# Altium schematic sheet Cap_Sensor_Hand.SchDoc
size A3
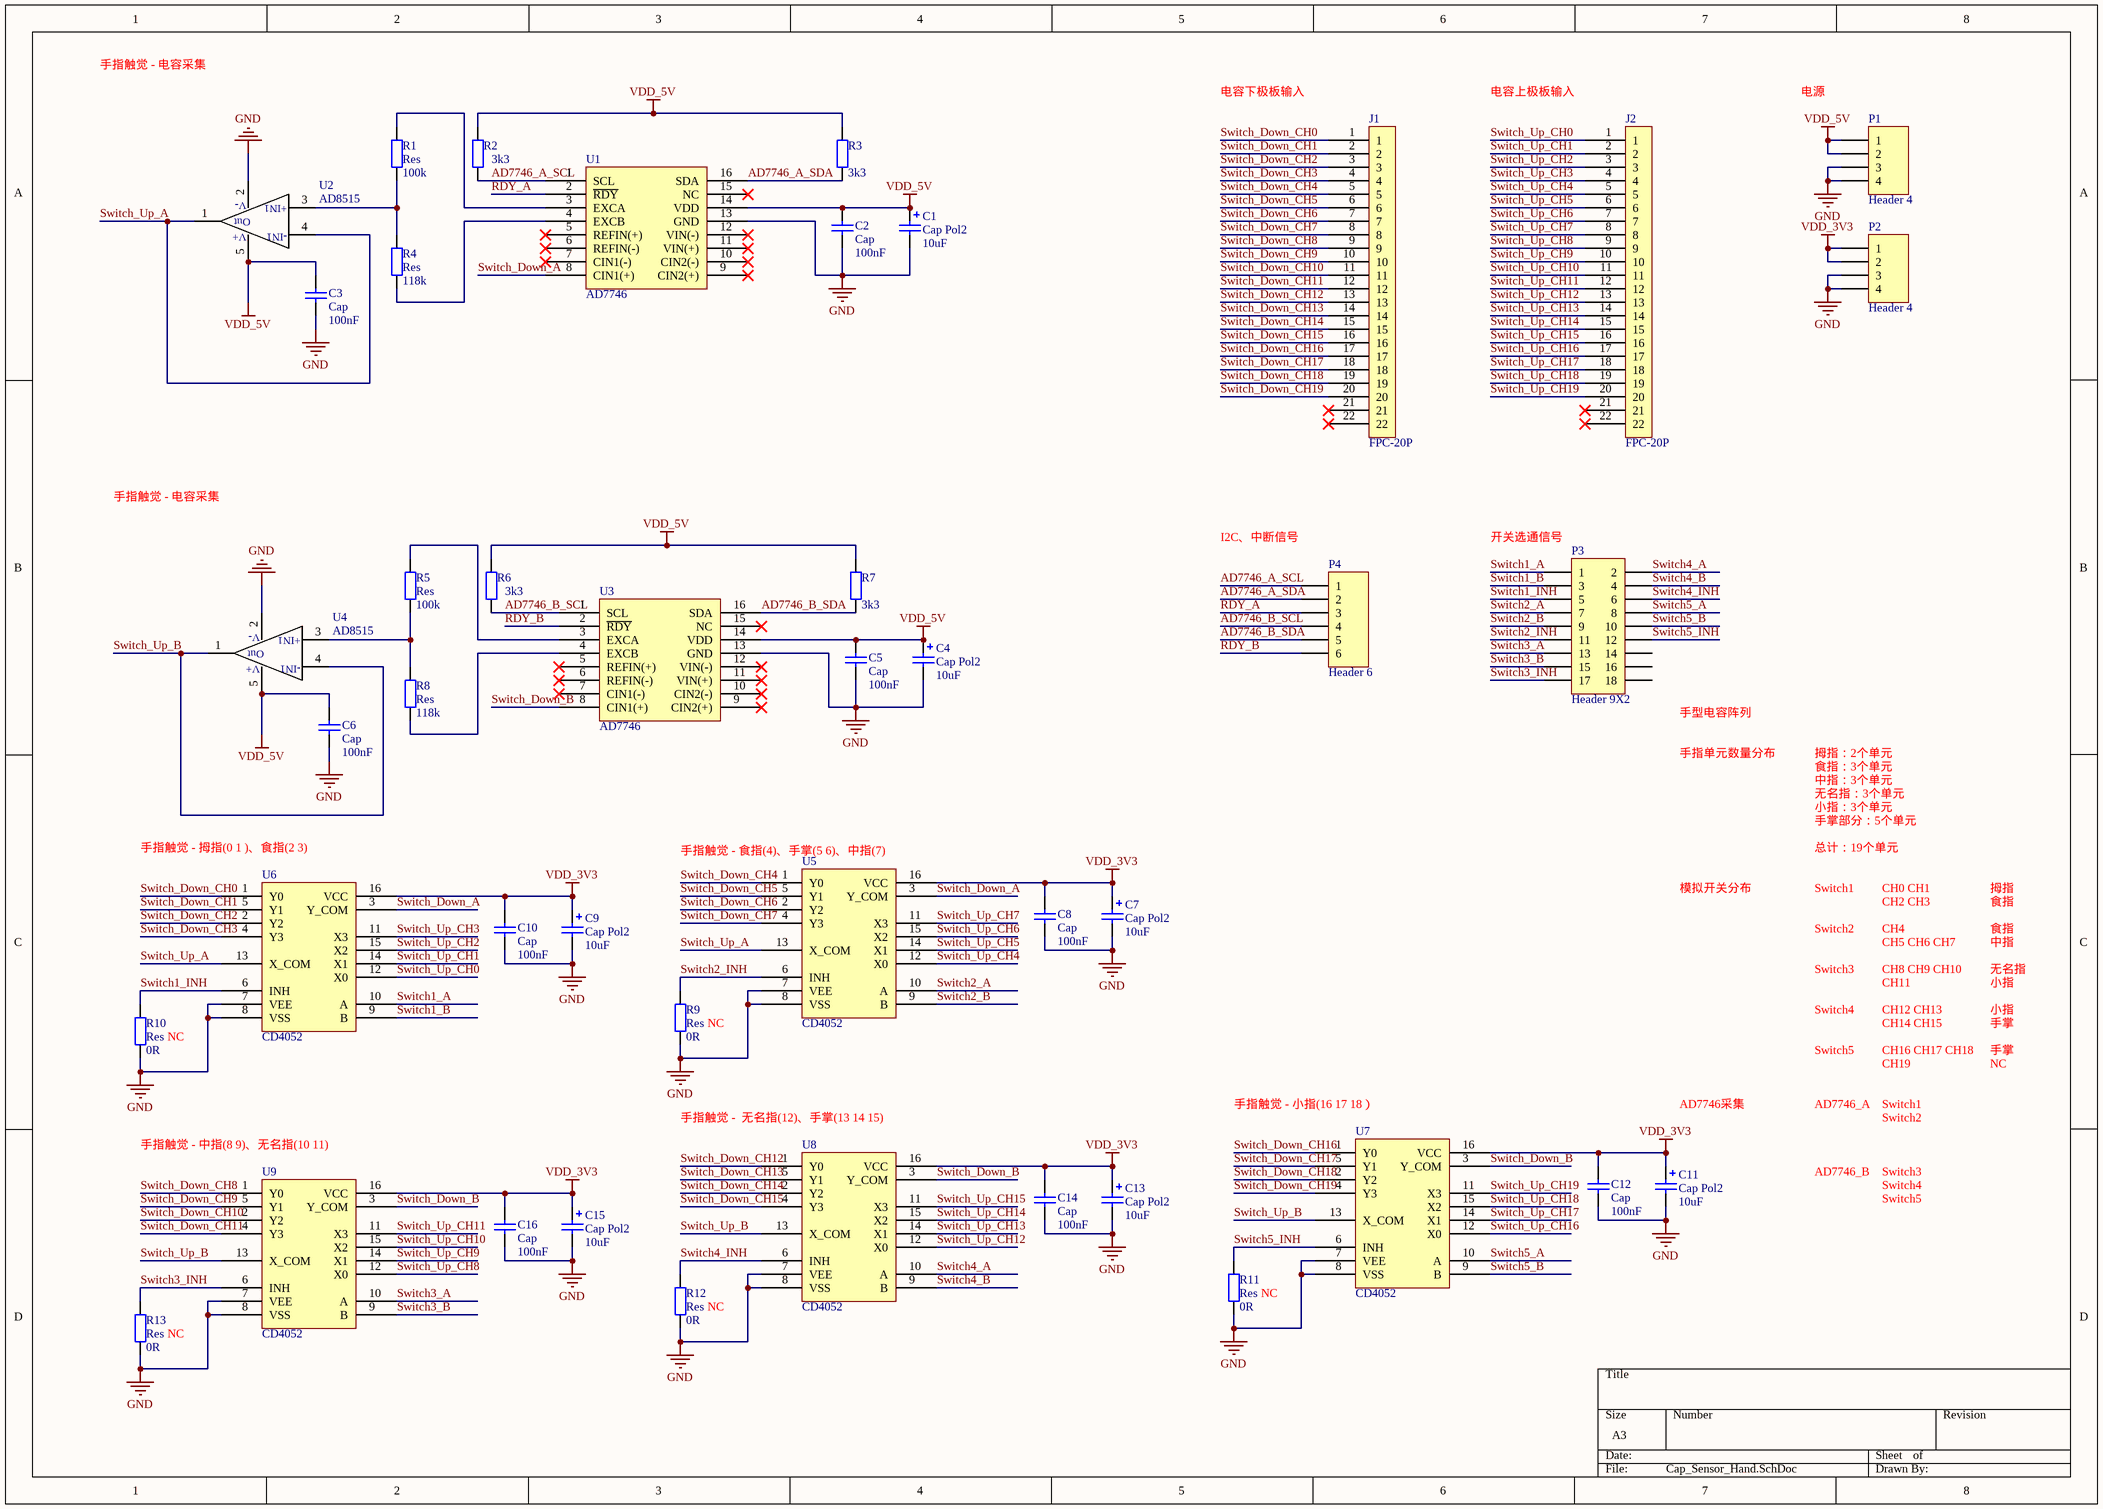
[diagram p0: Cap_Sensor_Hand.SchDoc]

## Parts
C1  Cap Pol2  value 10uF  [Cap-TA]
C2  Cap  value 100nF  [0805C]
C3  Cap  value 100nF  [0805C]
C4  Cap Pol2  value 10uF  [Cap-TA]
C5  Cap  value 100nF  [0805C]
C6  Cap  value 100nF  [0805C]
C7  Cap Pol2  value 10uF  [Cap-TA]
C8  Cap  value 100nF  [0805C]
C9  Cap Pol2  value 10uF  [Cap-TA]
C10  Cap  value 100nF  [0805C]
C11  Cap Pol2  value 10uF  [Cap-TA]
C12  Cap  value 100nF  [0805C]
C13  Cap Pol2  value 10uF  [Cap-TA]
C14  Cap  value 100nF  [0805C]
C15  Cap Pol2  value 10uF  [Cap-TA]
C16  Cap  value 100nF  [0805C]
J1  FPC-20P  [FPC20-0.5]
J2  FPC-20P  [FPC20-0.5]
P1  Header 4  [HDR1X4]
P2  Header 4  [HDR1X4]
P3  Header 9X2  [HDR2X9]
P4  Header 6  [HDR1X6]
R1  Res  value 100k  [0805R]
R2  value 3k3  [0805R]  (hidden comment: Res)
R3  value 3k3  [0805R]  (hidden comment: Res)
R4  Res  value 118k  [0805R]
R5  Res  value 100k  [0805R]
R6  value 3k3  [0805R]  (hidden comment: Res)
R7  value 3k3  [0805R]  (hidden comment: Res)
R8  Res  value 118k  [0805R]
R9  Res  value 0R  [0805R]
R10  Res  value 0R  [0805R]
R11  Res  value 0R  [0805R]
R12  Res  value 0R  [0805R]
R13  Res  value 0R  [0805R]
U1  AD7746  [TSSOP16]
U2  AD8515  [sot23-5]
U3  AD7746  [TSSOP16]
U4  AD8515  [sot23-5]
U5  CD4052  [sop16]
U6  CD4052  [SOP16]
U7  CD4052  [sop16]
U8  CD4052  [sop16]
U9  CD4052  [sop16]

## Nets
GND: C1.2 C2.1 C3.1 C4.2 C5.1 C6.1 C7.2 C8.1 C9.2 C10.1 C11.2 C12.1 C13.2 C14.1 C15.2 C16.1 P1.3 P1.4 P2.3 P2.4 R9.2 R10.2 R11.2 R12.2 R13.2 U1.13(GND) U2.2(V-) U3.13(GND) U4.2(V-) U5.7(VEE) U5.8(VSS) U6.7(VEE) U6.8(VSS) U7.7(VEE) U7.8(VSS) U8.7(VEE) U8.8(VSS) U9.7(VEE) U9.8(VSS)
VDD_3V3: C7.1 C8.2 C9.1 C10.2 C11.1 C12.2 C13.1 C14.2 C15.1 C16.2 P2.1 P2.2 U5.16(VCC) U6.16(VCC) U7.16(VCC) U8.16(VCC) U9.16(VCC)
VDD_5V: C1.1 C2.2 C3.2 C4.1 C5.2 C6.2 P1.1 P1.2 R2.2 R3.2 R6.2 R7.2 U1.14(VDD) U2.5(V+) U3.14(VDD) U4.5(V+)
AD7746_A_SCL: P4.1 R2.1 U1.1(SCL)
AD7746_A_SDA: P4.2 R3.1 U1.16(SDA)
AD7746_B_SCL: P4.4 R6.1 U3.1(SCL)
AD7746_B_SDA: P4.5 R7.1 U3.16(SDA)
RDY_A: P4.3 U1.2(~{RDY})
RDY_B: P4.6 U3.2(~{RDY})
Switch1_A: P3.1 U6.10(A)
Switch1_B: P3.3 U6.9(B)
Switch1_INH: P3.5 R10.1 U6.6(INH)
Switch2_A: P3.7 U5.10(A)
Switch2_B: P3.9 U5.9(B)
Switch2_INH: P3.11 R9.1 U5.6(INH)
Switch3_A: P3.13 U9.10(A)
Switch3_B: P3.15 U9.9(B)
Switch3_INH: P3.17 R13.1 U9.6(INH)
Switch4_A: P3.2 U8.10(A)
Switch4_B: P3.4 U8.9(B)
Switch4_INH: P3.6 R12.1 U8.6(INH)
Switch5_A: P3.8 U7.10(A)
Switch5_B: P3.10 U7.9(B)
Switch5_INH: P3.12 R11.1 U7.6(INH)
Switch_Down_A: U1.8(CIN1(+)) U5.3(Y_COM) U6.3(Y_COM)
Switch_Down_B: U3.8(CIN1(+)) U7.3(Y_COM) U8.3(Y_COM) U9.3(Y_COM)
Switch_Down_CH0: J1.1 U6.1(Y0)
Switch_Down_CH1: J1.2 U6.5(Y1)
Switch_Down_CH2: J1.3 U6.2(Y2)
Switch_Down_CH3: J1.4 U6.4(Y3)
Switch_Down_CH4: J1.5 U5.1(Y0)
Switch_Down_CH5: J1.6 U5.5(Y1)
Switch_Down_CH6: J1.7 U5.2(Y2)
Switch_Down_CH7: J1.8 U5.4(Y3)
Switch_Down_CH8: J1.9 U9.1(Y0)
Switch_Down_CH9: J1.10 U9.5(Y1)
Switch_Down_CH10: J1.11 U9.2(Y2)
Switch_Down_CH11: J1.12 U9.4(Y3)
Switch_Down_CH12: J1.13 U8.1(Y0)
Switch_Down_CH13: J1.14 U8.5(Y1)
Switch_Down_CH14: J1.15 U8.2(Y2)
Switch_Down_CH15: J1.16 U8.4(Y3)
Switch_Down_CH16: J1.17 U7.1(Y0)
Switch_Down_CH17: J1.18 U7.5(Y1)
Switch_Down_CH18: J1.19 U7.2(Y2)
Switch_Down_CH19: J1.20 U7.4(Y3)
Switch_Up_A: U2.1(Out1) U2.4(-IN) U5.13(X_COM) U6.13(X_COM)
Switch_Up_B: U4.1(Out1) U4.4(-IN) U7.13(X_COM) U8.13(X_COM) U9.13(X_COM)
Switch_Up_CH0: J2.1 U6.12(X0)
Switch_Up_CH1: J2.2 U6.14(X1)
Switch_Up_CH2: J2.3 U6.15(X2)
Switch_Up_CH3: J2.4 U6.11(X3)
Switch_Up_CH4: J2.5 U5.12(X0)
Switch_Up_CH5: J2.6 U5.14(X1)
Switch_Up_CH6: J2.7 U5.15(X2)
Switch_Up_CH7: J2.8 U5.11(X3)
Switch_Up_CH8: J2.9 U9.12(X0)
Switch_Up_CH9: J2.10 U9.14(X1)
Switch_Up_CH10: J2.11 U9.15(X2)
Switch_Up_CH11: J2.12 U9.11(X3)
Switch_Up_CH12: J2.13 U8.12(X0)
Switch_Up_CH13: J2.14 U8.14(X1)
Switch_Up_CH14: J2.15 U8.15(X2)
Switch_Up_CH15: J2.16 U8.11(X3)
Switch_Up_CH16: J2.17 U7.12(X0)
Switch_Up_CH17: J2.18 U7.14(X1)
Switch_Up_CH18: J2.19 U7.15(X2)
Switch_Up_CH19: J2.20 U7.11(X3)
NetR1_1: R1.1 U1.3(EXCA)
NetR1_2: R1.2 R4.1 U2.3(+IN)
NetR4_2: R4.2 U1.4(EXCB)
NetR5_1: R5.1 U3.3(EXCA)
NetR5_2: R5.2 R8.1 U4.3(+IN)
NetR8_2: R8.2 U3.4(EXCB)

Not connected (* = marked no-connect by the designer): J1 21* 22*; J2 21* 22*; P3 14 16 18; U1 5(REFIN(+))* 6(REFIN(-))* 7(CIN1(-))* 9(CIN2(+))* 10(CIN2(-))* 11(VIN(+))* 12(VIN(-))* 15(NC)*; U3 5(REFIN(+))* 6(REFIN(-))* 7(CIN1(-))* 9(CIN2(+))* 10(CIN2(-))* 11(VIN(+))* 12(VIN(-))* 15(NC)*

## Notes on the sheet
- 手指触觉 - 电容采集
- 电容下极板输入
- 电容上极板输入
- 电源
- I2C、中断信号
- (near P3) 开关选通信号
- 手型电容阵列
- 手指单元数量分布
- 拇指：2个单元
- 食指：3个单元
- 中指：3个单元
- (near U6) 手指触觉 - 拇指(0 1 )、食指(2 3)
- (near U5) 手指触觉 - 食指(4)、手掌(5 6)、中指(7)
- 无名指：3个单元
- 小指：3个单元
- 手掌部分：5个单元
- 总计：19个单元
- 模拟开关分布
- Switch1
- CH0 CH1
- CH2 CH3
- 拇指
- 食指
- Switch2
- Switch3
- CH4
- CH5 CH6 CH7
- CH8 CH9 CH10
- CH11
- 中指
- 无名指
- 小指
- (near R10) NC
- (near R9) NC
- Switch4
- Switch5
- CH12 CH13
- CH14 CH15
- CH16 CH17 CH18
- 手掌
- (near U8) 手指触觉 -  无名指(12)、手掌(13 14 15)
- (near U7) 手指触觉 - 小指(16 17 18）
- AD7746采集
- AD7746_A
- CH19
- NC
- (near U9) 手指触觉 - 中指(8 9)、无名指(10 11)
- AD7746_B
- (near R12) NC
- (near R11) NC
- (near R13) NC
- (in symbol AD8515) +IN1; Out; -IN1

## Library data of the parts
C1 C4 C7 C9 C11 C13 C15 = Cap Pol2: Polarized Capacitor (Axial); Published: 8-Jun-2000; LatestRevisionDate: 17-Jul-2002; LatestRevisionNote: Re-released for DXP Platform.; PackageReference: POLAR0.8; Publisher: Altium Limited; PackageDescription: Polarized Capacitor; 2 Leads
C2 C3 C5 C6 C8 C10 C12 C14 C16 = Cap: Capacitor; Published: 8-Jun-2000; LatestRevisionDate: 17-Jul-2002; LatestRevisionNote: Re-released for DXP Platform.; PackageReference: RAD-0.3; Publisher: Altium Limited; PackageDescription: Radial Cap, Thru-Hole; 2 Leads; 0.3 in Pin Spacing
J1 J2 = FPC_20P
P1 P2 = Header 4: Header, 4-Pin; LatestRevisionDate: 17-Jul-2002; LatestRevisionNote: Re-released for DXP Platform.; Publisher: Altium Limited
P3 = Header 9X2: Header, 9-Pin, Dual row; LatestRevisionDate: 17-Jul-2002; LatestRevisionNote: Re-released for DXP Platform.; Publisher: Altium Limited
P4 = Header 6: Header, 6-Pin; LatestRevisionDate: 17-Jul-2002; LatestRevisionNote: Re-released for DXP Platform.; Publisher: Altium Limited
R1-R13 = Res: Resistor; Published: 8-Jun-2000; LatestRevisionDate: 17-Jul-2002; LatestRevisionNote: Re-released for DXP Platform.; PackageReference: AXIAL-0.4; Publisher: Altium Limited; PackageDescription: Axial Device, Thru-Hole; 2 Leads; 0.4 in Pin Spacing